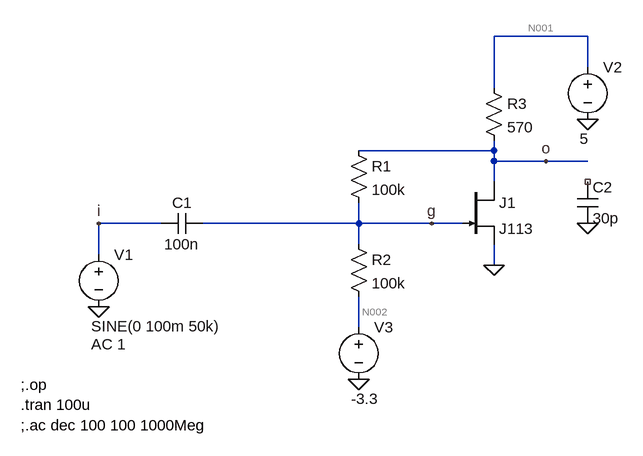
[diagram p0: schematic fig2.asc]
fig2.asc, the LTspice schematic file:
Version 4
SHEET 1 1620 680
WIRE 64 -240 -80 -240
WIRE 64 -192 64 -240
WIRE -80 -160 -80 -240
WIRE -80 -64 -80 -80
WIRE -80 -64 -288 -64
WIRE -80 -48 -80 -64
WIRE 0 -48 -80 -48
WIRE 64 -48 0 -48
WIRE -80 -16 -80 -48
WIRE -592 48 -688 48
WIRE -288 48 -288 16
WIRE -288 48 -528 48
WIRE -176 48 -288 48
WIRE -128 48 -176 48
WIRE -288 80 -288 48
WIRE -688 96 -688 48
WIRE -80 112 -80 80
WIRE -288 208 -288 160
FLAG 64 -112 0
FLAG -688 176 0
FLAG -80 112 0
FLAG -288 288 0
FLAG -688 48 i
FLAG -176 48 g
FLAG 0 -48 o
FLAG 64 48 0
SYMBOL voltage 64 -208 R0
WINDOW 123 0 0 Left 0
WINDOW 39 0 0 Left 0
WINDOW 3 -12 126 Left 2
SYMATTR Value 5
SYMATTR InstName V2
SYMBOL voltage -688 80 R0
WINDOW 123 -12 154 Left 2
WINDOW 39 0 0 Left 0
WINDOW 3 -12 126 Left 2
SYMATTR Value2 AC 1
SYMATTR Value SINE(0 100m 50k)
SYMATTR InstName V1
SYMBOL njf -128 -16 R0
SYMATTR InstName J1
SYMATTR Value J113
SYMBOL cap -528 32 R90
WINDOW 0 0 32 VBottom 2
WINDOW 3 32 32 VTop 2
SYMATTR InstName C1
SYMATTR Value 100n
SYMBOL res -304 -80 R0
SYMATTR InstName R1
SYMATTR Value 100k
SYMBOL res -304 64 R0
SYMATTR InstName R2
SYMATTR Value 100k
SYMBOL voltage -288 192 R0
WINDOW 123 0 0 Left 0
WINDOW 39 0 0 Left 0
WINDOW 3 -12 126 Left 2
SYMATTR Value -3.3
SYMATTR InstName V3
SYMBOL cap 48 -16 R0
SYMATTR InstName C2
SYMATTR Value 30p
SYMBOL res -96 -176 R0
SYMATTR InstName R3
SYMATTR Value 570
TEXT -808 296 Left 2 !;.op\n.tran 100u\n;.ac dec 100 100 1000Meg

The netlist it stands for:
* fig2.asc
V2 N001 0 5
V1 i 0 SINE(0 100m 50k) AC 1
J1 o g 0 J113
C1 g i 100n
R1 o g 100k
R2 g N002 100k
V3 N002 0 -3.3
C2 NC_01 0 30p
R3 N001 o 570
.model NJF NJF
.model PJF PJF
.lib standard.jft
;.op
.tran 100u
;.ac dec 100 100 1000Meg
.backanno
.end

* Results of the author's LTspice run, read from the files saved beside the schematic
* Operating Point, zero values left out:
*   V(n001) = 5 V
*   V(o) = 2.04 V
*   V(g) = -629.8 mV
*   V(n002) = -3.3 V
*   Id(J1) = 5.166 mA
*   Ig(J1) = -9.513 pA
*   Is(J1) = -5.166 mA
*   I(R3) = 5.192 mA
*   I(R2) = 26.7 µA
*   I(R1) = 26.7 µA
*   I(V3) = 26.7 µA
*   I(V2) = -5.192 mA